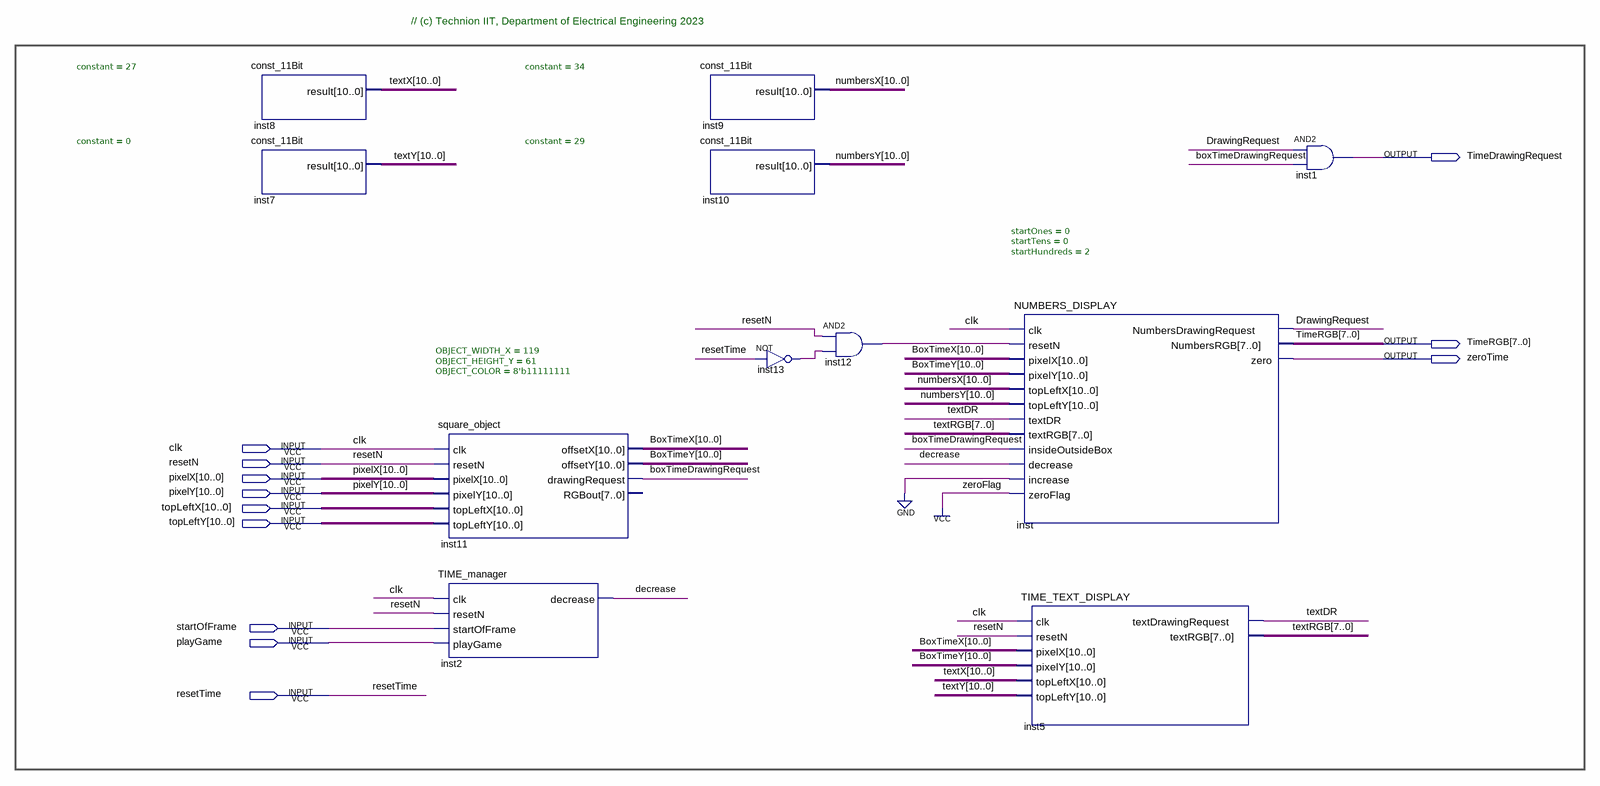
[diagram p0: schematic sheet]
// Quartus schematic TIME_DISPLAY.bdf as structural Verilog: 11 symbols, 12 pins
module TIME_DISPLAY (
  input  clk,
  input  resetN,
  input  [10:0] pixelX,
  input  [10:0] pixelY,
  input  [10:0] topLeftX,
  input  [10:0] topLeftY,
  input  startOfFrame,
  input  playGame,
  input  resetTime,
  output TimeDrawingRequest,
  output [7:0] TimeRGB,
  output zeroTime
);

  wire boxTimeDrawingRequest, decrease, DrawingRequest, inst12_out, inst13_out, textDR;
  wire [7:0] textRGB;
  wire [10:0] BoxTimeX, BoxTimeY, numbersX, numbersY, textX, textY;

  const_11Bit #(.constant(27)) inst8 (.result(textX));
  const_11Bit #(.constant(0)) inst7 (.result(textY));
  square_object #(.OBJECT_WIDTH_X(119), .OBJECT_HEIGHT_Y(61), .OBJECT_COLOR(8'b11111111)) inst11 (
    .clk(clk), .resetN(resetN), .pixelX(pixelX), .pixelY(pixelY), .topLeftX(topLeftX), .topLeftY(topLeftY),
    .offsetX(BoxTimeX), .offsetY(BoxTimeY), .drawingRequest(boxTimeDrawingRequest));  // open: RGBout
  TIME_manager inst2 (
    .clk(clk), .resetN(resetN), .startOfFrame(startOfFrame), .playGame(playGame), .decrease(decrease));
  const_11Bit #(.constant(34)) inst9 (.result(numbersX));
  const_11Bit #(.constant(29)) inst10 (.result(numbersY));
  not inst13 (inst13_out, resetTime);
  and inst12 (inst12_out, resetN, inst13_out);
  NUMBERS_DISPLAY #(.startOnes(0), .startTens(0), .startHundreds(2)) inst (
    .clk(clk), .resetN(inst12_out), .pixelX(BoxTimeX), .pixelY(BoxTimeY), .topLeftX(numbersX),
    .topLeftY(numbersY), .textDR(textDR), .textRGB(textRGB), .insideOutsideBox(boxTimeDrawingRequest),
    .decrease(decrease), .increase(1'b0), .zeroFlag(1'b1), .NumbersDrawingRequest(DrawingRequest),
    .NumbersRGB(TimeRGB), .zero(zeroTime));
  TIME_TEXT_DISPLAY inst5 (
    .clk(clk), .resetN(resetN), .pixelX(BoxTimeX), .pixelY(BoxTimeY), .topLeftX(textX), .topLeftY(textY),
    .textDrawingRequest(textDR), .textRGB(textRGB));
  and inst1 (TimeDrawingRequest, DrawingRequest, boxTimeDrawingRequest);

  // Notes on the sheet:
  //   // (c) Technion IIT, Department of Electrical Engineering 2023
endmodule
